# EAGLE design board_d-01-buttons (EAGLE 8.1.1)
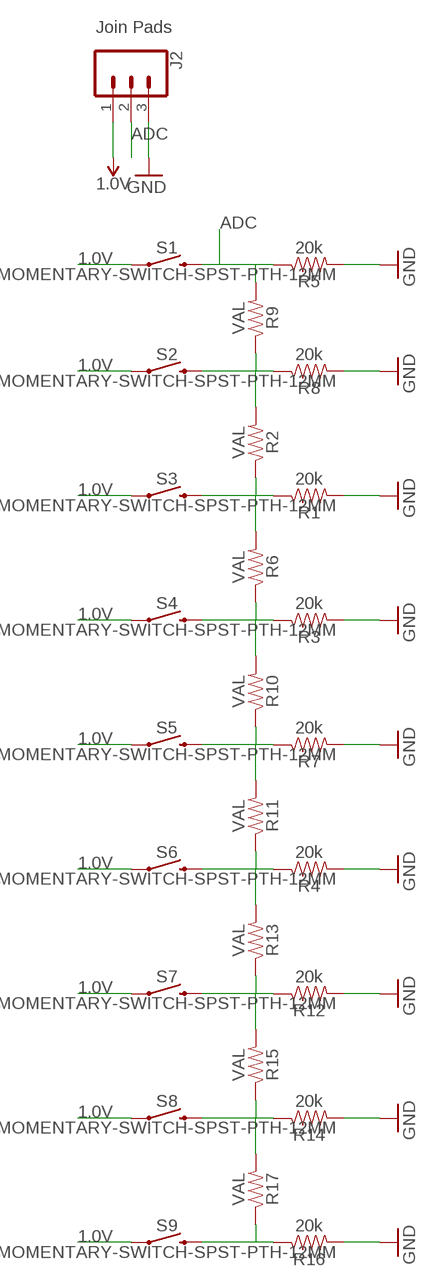
[diagram p0: schematic, sheet 1]

## Parts
J2  CONN_03LOCK_LONGPADS  [1X03_LOCK_LONGPADS]
R1  20k  1KOHM-HORIZ-1/4W-1%  [AXIAL-0.3]
R2  VAL  1KOHM-HORIZ-1/4W-1%  [AXIAL-0.3]
R3  20k  1KOHM-HORIZ-1/4W-1%  [AXIAL-0.3]
R4  20k  1KOHM-HORIZ-1/4W-1%  [AXIAL-0.3]
R5  20k  1KOHM-HORIZ-1/4W-1%  [AXIAL-0.3]
R6  VAL  1KOHM-HORIZ-1/4W-1%  [AXIAL-0.3]
R7  20k  1KOHM-HORIZ-1/4W-1%  [AXIAL-0.3]
R8  20k  1KOHM-HORIZ-1/4W-1%  [AXIAL-0.3]
R9  VAL  1KOHM-HORIZ-1/4W-1%  [AXIAL-0.3]
R10  VAL  1KOHM-HORIZ-1/4W-1%  [AXIAL-0.3]
R11  VAL  1KOHM-HORIZ-1/4W-1%  [AXIAL-0.3]
R12  20k  1KOHM-HORIZ-1/4W-1%  [AXIAL-0.3]
R13  VAL  1KOHM-HORIZ-1/4W-1%  [AXIAL-0.3]
R14  20k  1KOHM-HORIZ-1/4W-1%  [AXIAL-0.3]
R15  VAL  1KOHM-HORIZ-1/4W-1%  [AXIAL-0.3]
R16  20k  1KOHM-HORIZ-1/4W-1%  [AXIAL-0.3]
R17  VAL  1KOHM-HORIZ-1/4W-1%  [AXIAL-0.3]
S1  MOMENTARY-SWITCH-SPST-PTH-12MM  [TACTILE_SWITCH_PTH_12MM]
S2  MOMENTARY-SWITCH-SPST-PTH-12MM  [TACTILE_SWITCH_PTH_12MM]
S3  MOMENTARY-SWITCH-SPST-PTH-12MM  [TACTILE_SWITCH_PTH_12MM]
S4  MOMENTARY-SWITCH-SPST-PTH-12MM  [TACTILE_SWITCH_PTH_12MM]
S5  MOMENTARY-SWITCH-SPST-PTH-12MM  [TACTILE_SWITCH_PTH_12MM]
S6  MOMENTARY-SWITCH-SPST-PTH-12MM  [TACTILE_SWITCH_PTH_12MM]
S7  MOMENTARY-SWITCH-SPST-PTH-12MM  [TACTILE_SWITCH_PTH_12MM]
S8  MOMENTARY-SWITCH-SPST-PTH-12MM  [TACTILE_SWITCH_PTH_12MM]
S9  MOMENTARY-SWITCH-SPST-PTH-12MM  [TACTILE_SWITCH_PTH_12MM]

## Nets
1.0V: J2.1 S1.1 S2.1 S3.1 S4.1 S5.1 S6.1 S7.1 S8.1 S9.1
ADC: J2.2 R5.P$1 R9.P$2 S1.3
GND: J2.3 R1.P$2 R3.P$2 R4.P$2 R5.P$2 R7.P$2 R8.P$2 R12.P$2 R14.P$2 R16.P$2
N$1: R1.P$1 R2.P$1 R6.P$2 S3.3
N$2: R3.P$1 R6.P$1 R10.P$2 S4.3
N$3: R7.P$1 R10.P$1 R11.P$2 S5.3
N$4: R4.P$1 R11.P$1 R13.P$2 S6.3
N$5: R2.P$2 R8.P$1 R9.P$1 S2.3
N$6: R12.P$1 R13.P$1 R15.P$2 S7.3
N$7: R14.P$1 R15.P$1 R17.P$2 S8.3
N$9: R16.P$1 R17.P$1 S9.3

## Notes on the sheet
- Join Pads

## Library data of the parts
J2 = SparkFun-Connectors:CONN_03: Multi connection point. Often used as Generic Header-pin footprint for 0.1 inch spaced/style header connections On any of the 0.1 inch spaced packages, you can populate with these: Break Away Headers - Straight <https://www.sparkfun.com/products/116> (PRT-00116) Break Away Male Headers - Right Angle <https://www.sparkfun.com/products/553> (PRT-00553) Female Headers <https://www.sparkfun.com/products/115> (PRT-00115) Break Away Headers - Machine Pin <https://www.sparkfun.com/products/117> (PRT-00117) Break Away Female Headers - Swiss Machine Pin <https://www.sparkfun.com/products/743> (PRT-00743) Stackable Header - 3 Pin (Female, 0.1") <https://www.sparkfun.com/products/13875> (PRT-13875) For SCREWTERMINALS and SPRING TERMINALS visit here: Screw Terimnals on SparkFun.com <https://www.sparkfun.com/search/results?term=Screw+Terminals> (5mm/3.5mm/2.54mm spacing) This device is also useful as a general connection point to wire up your design to another part of your project. Our various solder wires solder well into these plated through hole pads. Hook-Up Wire - Assortment (Stranded, 22 AWG) <https://www.sparkfun.com/products/11375> (PRT-11375) Hook-Up Wire - Assortment (Solid Core, 22 AWG) <https://www.sparkfun.com/products/11367> (PRT-11367) View the entire wire category on our website here <https://www.sparkfun.com/categories/141> Special notes: Molex polarized connector foot print use with SKU : PRT-08232 with associated crimp pins and housings.
R1-R17 = SparkFun-Resistors:1KOHM: 1kΩ resistor A resistor is a passive two-terminal electrical component that implements electrical resistance as a circuit element. Resistors act to reduce current flow, and, at the same time, act to lower voltage levels within circuits. - Wikipedia; PROD_ID: RES-12182; VALUE: 1k
S1-S9 = SparkFun-Switches:MOMENTARY-SWITCH-SPST: Momentary Switch (Pushbutton) - SPST Normally-open (NO) SPST momentary switches (buttons, pushbuttons). Variants PTH-12MM - 12mm square, through-hole Momentary Pushbutton Switch - 12mm Square <https://www.sparkfun.com/products/9190> (COM-09190) PTH-6.0MM, PTH-6.0MM-KIT - 6.0mm square, through-hole Mini Pushbutton Switch <https://www.sparkfun.com/products/97> (COM-00097) KIT package intended for soldering kit's - only one side of pads' copper is exposed. PTH-RIGHT-ANGLE-KIT - Right-angle, through-hole Right Angle Tactile Button <https://www.sparkfun.com/products/10791> - Used on SparkFun BigTime Watch Kit <https://www.sparkfun.com/products/11734> SMD-12MM - 12mm square, surface-mount Tactile Button - SMD (12mm) <https://www.sparkfun.com/products/12993> (COM-12993) Used on SparkFun PicoBoard <https://www.sparkfun.com/products/11888> SMD-4.5MM - 4.5mm Square Trackball Switch Used on SparkFun Blackberry Trackballer Breakout <https://www.sparkfun.com/products/13169> SMD-4.6MMX2.8MM - 4.60mm x 2.80mm, surface mount Used on SparkFun SAMD21 Mini Breakout <https://www.sparkfun.com/products/13664> SMD-5.2MM, SMD-5.2-REDUNDANT - 5.2mm square, surface-mount Mini Pushbutton Switch - SMD <https://www.sparkfun.com/products/8720> (COM-08720) Used on Arduino Pro Mini <https://www.sparkfun.com/products/11114> REDUNDANT package connects both switch circuits together SMD-6.0X3.5MM - 6.0 x 3.5mm, surface mount Momentary Reset Switch SMD <https://www.sparkfun.com/products/8229> (COM-08229) SMD-6.2MM-TALL - 6.2mm square, surface mount Tactile Button - SMD (6mm) <https://www.sparkfun.com/products/12992> Used on SparkFun Digital Sandbox <https://www.sparkfun.com/products/12651> SMD-RIGHT-ANGLE - Right-angle, surface mount Used on SparkFun Block for Intel® Edison - Arduino <https://www.sparkfun.com/products/13036>; PROD_ID: SWCH-09185; SF_SKU: COM-09190

## Board
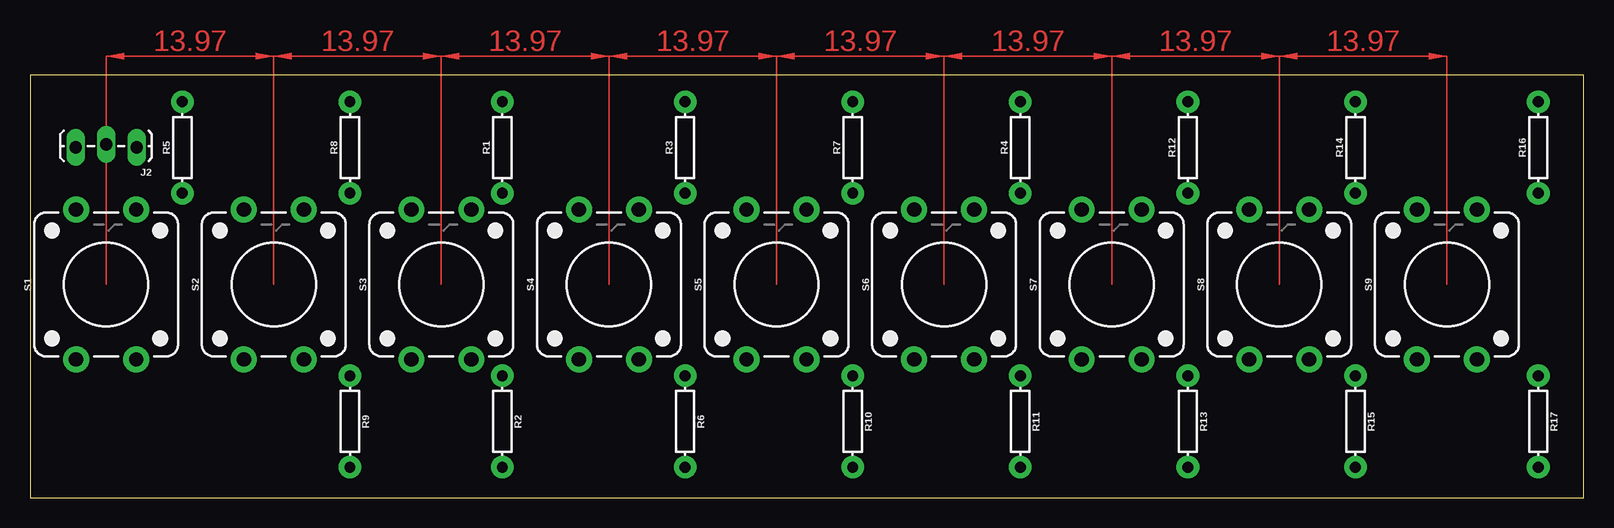
[diagram p1: board, top side]
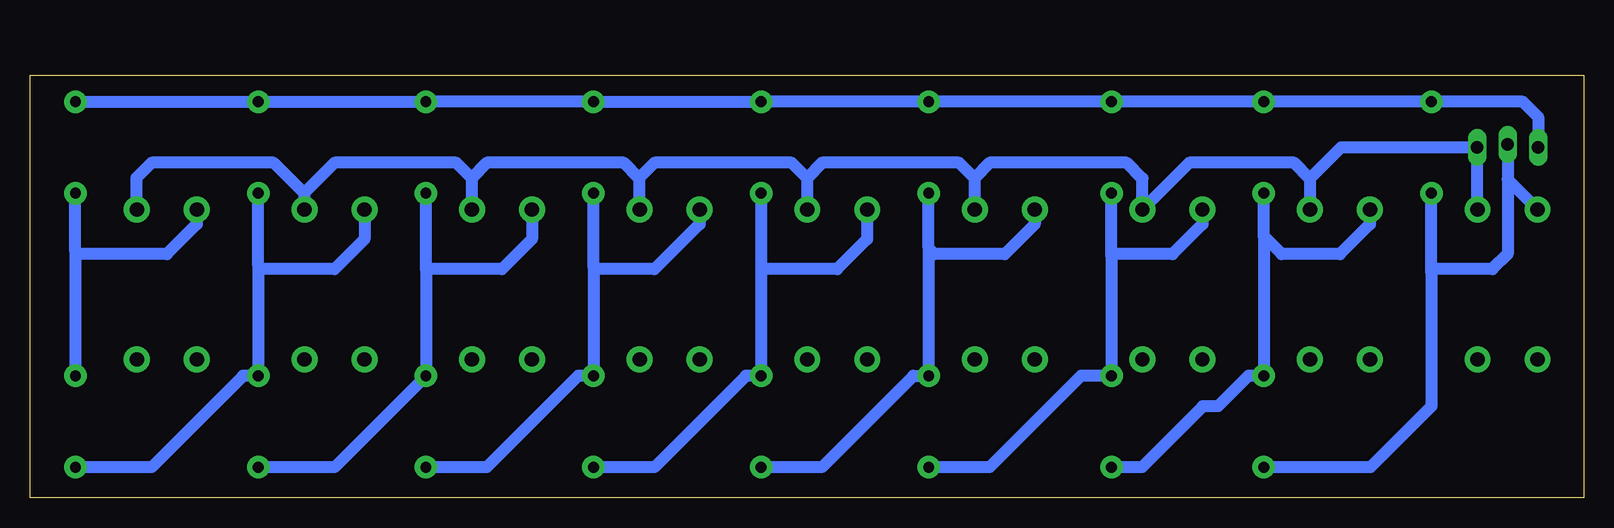
[diagram p2: board, bottom side, seen from below]

Size 129.52 x 35.23 mm. Coordinates in mm from the lower left corner, seen from the top.
Outline: 0,0 129.52,0 129.52,35.23 0,35.23 0,0
Copper layers (1*16): Top 0.035mm / dielectric 1.5mm / Bottom 0.035mm
Design rules "default": minimum track width 10mil, minimum drill 24mil, track to track 8mil, track to pad 8mil, pad to pad 8mil, via to via 8mil, smd to smd 8mil, copper to edge 40mil, drill to drill 8mil, minimum pad ring 10mil, minimum via ring 8mil, stop-mask expansion 4mil, vias tented up to drill 0mil, thermal gap 10mil

### Footprints (pad centres in the part's own frame; a part is rotated, then mirrored left to right if it is on the bottom)
1X03_LOCK_LONGPADS = drill 1.016 long: 1 0,0; 2 2.54,-0.254; 3 5.08,0
AXIAL-0.3 = drill 0.9 pad 1.88: P$1 -3.81,0; P$2 3.81,0
TACTILE_SWITCH_PTH_12MM = drill 1.2 pad 2.159: 1 6.25,-2.5; 2 -6.25,-2.5; 3 6.25,2.5; 4 -6.25,2.5

### Placement (x,y rotation side)
J2  8.89,29.21 180 top
R1  39.37,29.21 90 top
R2  39.37,6.35 270 top
R3  54.61,29.21 90 top
R4  82.55,29.21 90 top
R5  12.7,29.21 90 top
R6  54.61,6.35 270 top
R7  68.58,29.21 90 top
R8  26.67,29.21 90 top
R9  26.67,6.35 270 top
R10  68.58,6.35 270 top
R11  82.55,6.35 270 top
R12  96.52,29.21 90 top
R13  96.52,6.35 270 top
R14  110.49,29.21 90 top
R15  110.49,6.35 270 top
R16  125.73,29.21 90 top
R17  125.73,6.35 270 top
S1  6.35,17.78 90 top
S2  20.32,17.78 90 top
S3  34.29,17.78 90 top
S4  48.26,17.78 90 top
S5  62.23,17.78 90 top
S6  76.2,17.78 90 top
S7  90.17,17.78 90 top
S8  104.14,17.78 90 top
S9  118.11,17.78 90 top

### Tracks (layer width: path | path; a pad name or v marks a point on that pad's centre or on a via)
1.0V
  Bottom 1.016: 22.82,26.63 S2.1 | 22.82,26.63 24.13,27.94 32.88,27.94 S3.1 36.79,26.63 38.1,27.94 49.53,27.94 50.8,26.67 | S1.1 8.89,24.07 J2.1 20.24,29.21 22.82,26.63 | 50.8,26.67 50.8,24.07 S4.1 | 50.8,26.67 52.07,27.94 63.5,27.94 64.77,26.67 | 64.77,26.67 64.77,24.07 S5.1 | 64.77,26.67 66.04,27.94 77.47,27.94 78.74,26.67 | 78.74,26.67 78.74,24.07 S6.1 | 78.74,26.67 80.01,27.94 91.44,27.94 92.71,26.67 | 92.71,26.67 92.71,24.07 S7.1 | 92.71,26.67 93.98,27.94 104.14,27.94 106.68,25.4 | 106.68,25.4 106.68,24.07 S8.1 | 106.68,25.4 109.22,27.94 119.38,27.94 120.65,26.67 120.65,24.07 S9.1
ADC
  Bottom 1.016: J2.2 6.35,26.53 | 6.35,26.53 S1.3 | 12.7,18.76 R5.P$1 | 12.7,18.76 12.7,7.62 17.78,2.54 R9.P$2 | 6.35,26.53 6.35,20.32 7.62,19.05 12.41,19.05 12.7,18.76
GND
  Bottom 1.016: J2.3 3.81,31.75 5.08,33.02 R5.P$2 R8.P$2 R1.P$2 R3.P$2 R7.P$2 R4.P$2 R12.P$2 R14.P$2 R16.P$2
N$1
  Bottom 1.016: 39.37,20.07 R1.P$1 | 39.37,20.07 R2.P$1 41.91,10.16 49.53,2.54 R6.P$2 | S3.3 31.79,22.82 34.29,20.32 39.12,20.32 39.37,20.07
N$2
  Bottom 1.016: R10.P$2 63.5,2.54 55.88,10.16 R6.P$1 54.61,20.8 | 54.61,20.8 R3.P$1 | S4.3 45.76,22.82 48.26,20.32 54.13,20.32 54.61,20.8
N$3
  Bottom 1.016: S5.3 59.73,21.55 62.23,19.05 68.58,19.05 | R7.P$1 68.58,19.05 | 68.58,19.05 R10.P$1 69.85,10.16 77.47,2.54 R11.P$2
N$4
  Bottom 1.016: 82.55,19.3 R4.P$1 | 82.55,19.3 R11.P$1 83.82,10.16 91.44,2.54 R13.P$2 | S6.3 73.7,22.82 77.47,19.05 82.3,19.05 82.55,19.3
N$5
  Bottom 1.016: R2.P$2 36.83,2.54 31.75,7.62 30.48,7.62 27.94,10.16 R9.P$1 26.67,21.8 | 26.67,21.8 R8.P$1 | S2.3 17.82,22.82 20.32,20.32 25.19,20.32 26.67,21.8
N$6
  Bottom 1.016: 96.52,19.05 R12.P$1 | 96.52,19.05 R13.P$1 104.14,2.54 R15.P$2 | S7.3 87.67,21.55 90.17,19.05 96.52,19.05
N$7
  Bottom 1.016: 110.49,19.36 R14.P$1 | 110.49,19.36 R15.P$1 111.76,10.16 119.38,2.54 R17.P$2 | S8.3 101.64,21.55 104.14,19.05 110.18,19.05 110.49,19.36
N$9
  Bottom 1.016: 125.73,20.53 R16.P$1 | 125.73,20.53 R17.P$1 | S9.3 115.61,22.82 118.11,20.32 125.52,20.32 125.73,20.53
(copper drawn outside any net)
  shapes: Top area x8